# EasyEDA Pro project ProPrj_四串锂电池电源-2_2025-05-26.epro, board PCBV2
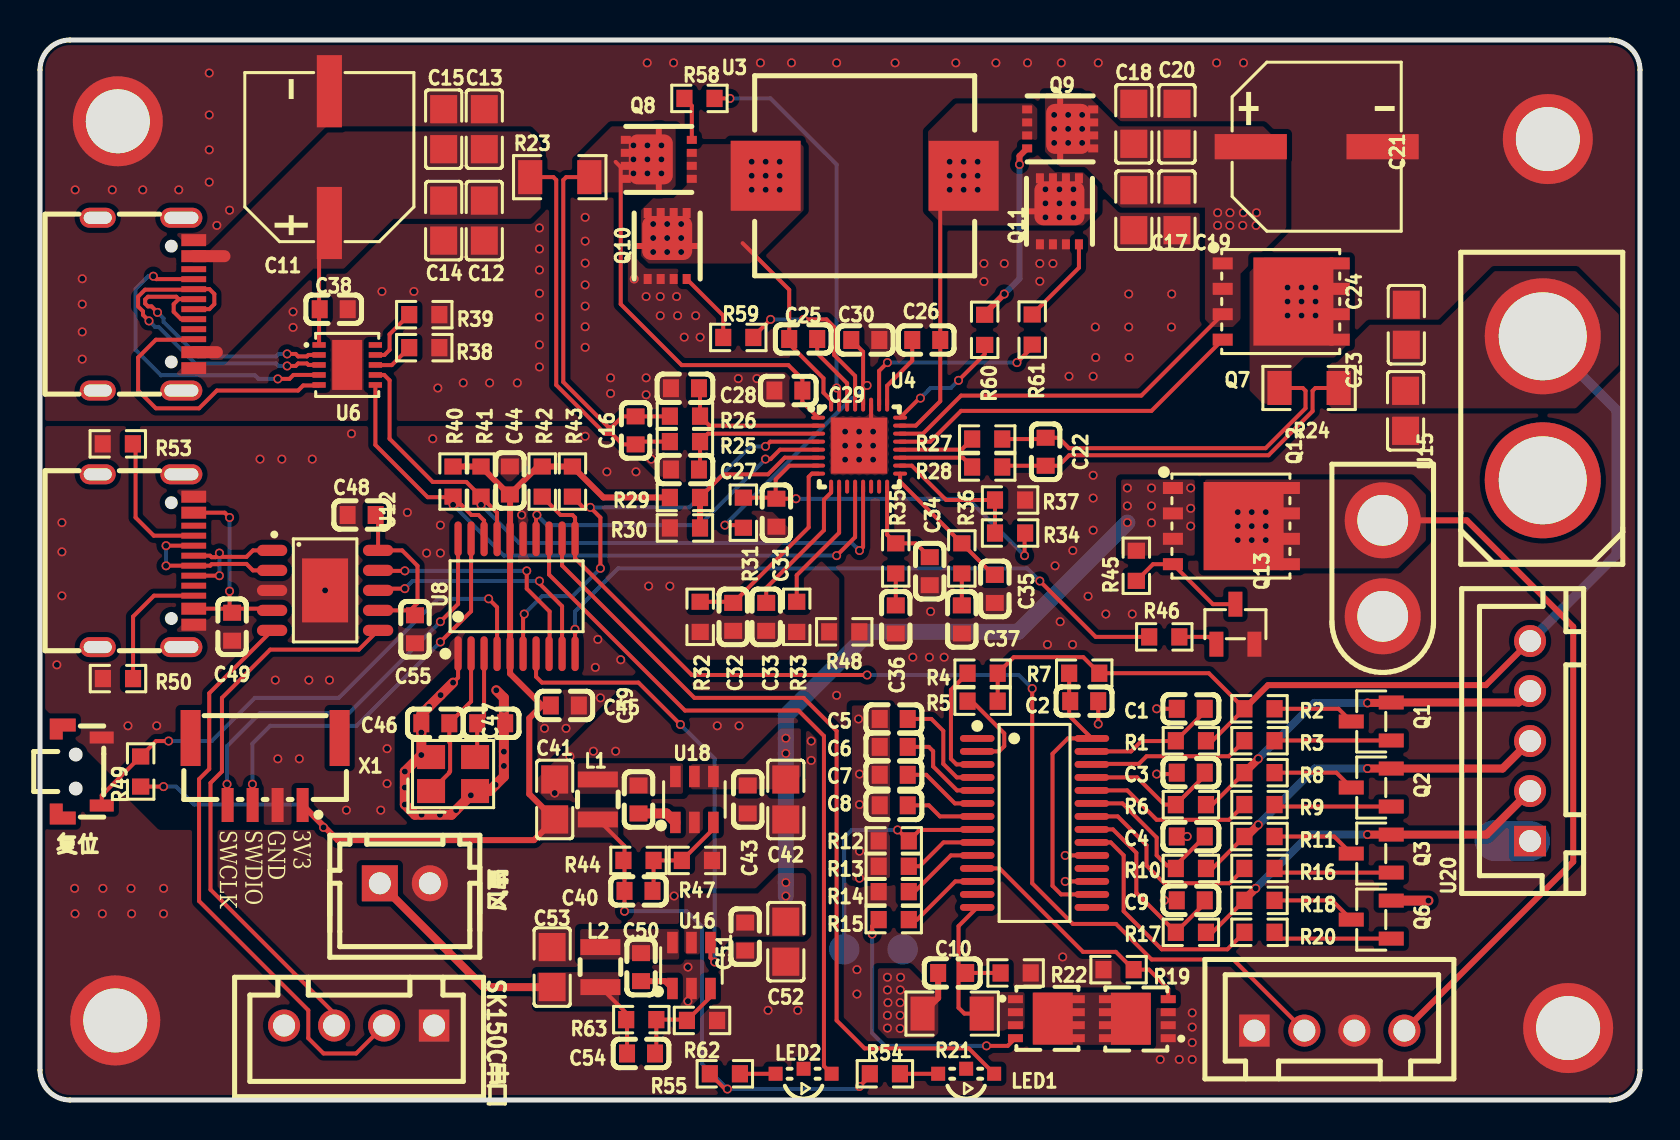
[diagram p12: board, top side]
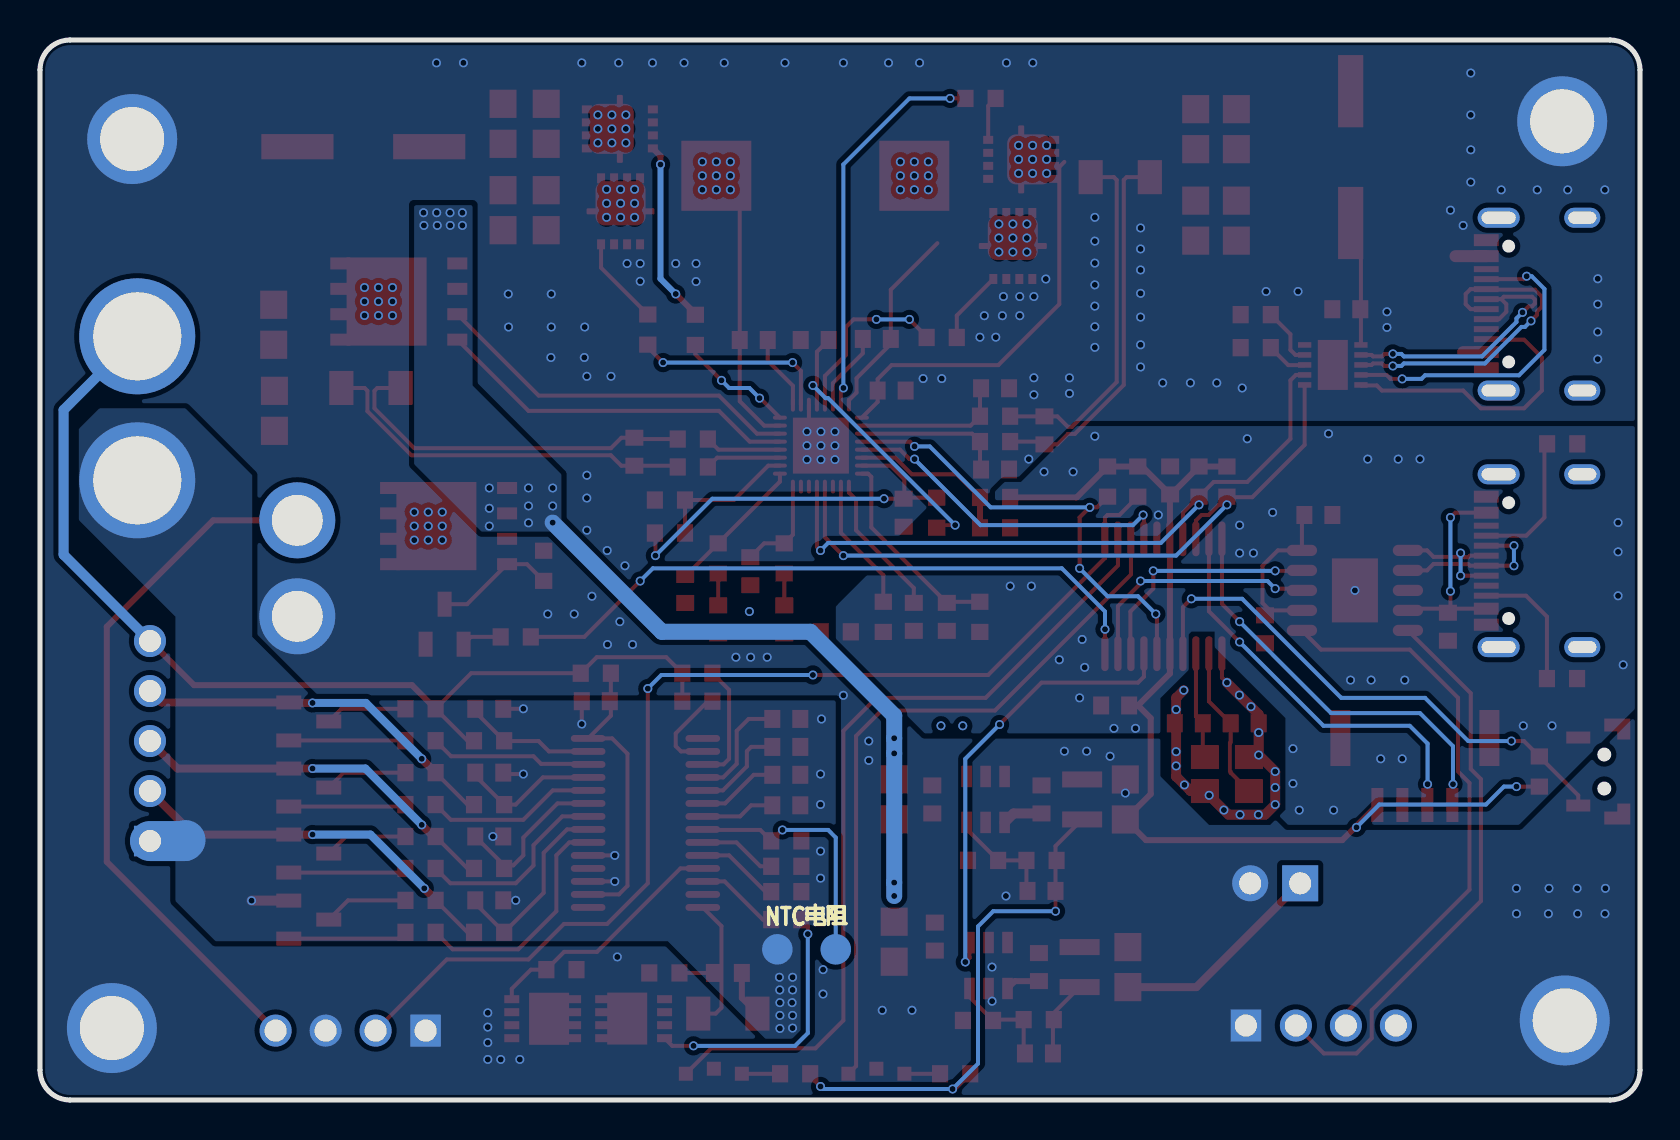
[diagram p13: board, bottom side, seen from below]

Outline 80 x 53 mm; copper layers: Top Layer, Bottom Layer. Coordinates in mm from the lower left corner of the outline.
Outline path: 0,51.5 0,1.5 arc(0.44,0.44) 1.5,0 78.5,0 arc(79.56,0.44) 80,1.5 80,51.5 arc(79.56,52.56) 78.5,53 1.5,53 arc(0.44,52.56) 0,51.5
Stack: Top Layer 0.035mm / Dielectric1 1.51mm FR4 er 4.5 / Bottom Layer 0.035mm

## Design rules (mm)
net BAT4: DP3
net $3N1407: DP4
net $3N1440: DP4
net $2N9896: DP2
net VBUS: DP2
net $2N9908: DP3
net D+: DP1
net D-: DP1
template: 自定义配置
spacing copperThickness1oz (default): track to track 0.102, other pairs 0.152 to 0.3
spacing copperThickness2oz: track to track 0.203, other pairs 0.152 to 0.3
track width copperThickness1oz (default): min 0.127, default 0.254, max 5
track width copperThickness2oz: min 0.203, default 0.254, max 2.54
differential pair differentialPair (default): width min 0.127, default 0.254, max 2.54; gap min 0.152, default 0.152
via viaSize (default): diameter min 0.45, default 0.61, max 10; hole min 0.3, default 0.305, max 6.3

## Placement (name value [footprint] x y rotation side)
C1  100nF  [C0603]  57.54 19.56 180 top
C2  10uF  [C0603]  52.21 19.94 0 top
C3  100nF  [C0603]  57.54 16.37 180 top
C4  100nF  [C0603]  57.54 13.18 180 top
C5  100nF  [C0603]  42.69 19.05 180 top
C6  100nF  [C0603]  42.69 17.66 180 top
C7  100nF  [C0603]  42.69 16.26 180 top
C8  100nF  [C0603]  42.69 14.73 180 top
C9  100nF  [C0603]  57.54 9.98 180 top
C10  10nF  [C0603]  45.61 6.35 180 top
C11  220uF  [CAP-SMD_BD8.0-L8.3-W8.3-LS9.0-FD]  14.47 47.14 90 top
C12  22uF  [C0805]  22.21 43.97 270 top
C13  22uF  [C0805]  22.21 48.54 90 top
C14  22uF  [C0805]  20.18 43.97 270 top
C15  22uF  [C0805]  20.18 48.54 90 top
C16  100nF  [C0603]  29.78 33.48 90 top
C17  22uF  [C0805]  54.69 44.49 270 top
C18  22uF  [C0805]  54.69 48.81 90 top
C19  22uF  [C0805]  56.85 44.49 270 top
C20  22uF  [C0805]  56.85 48.81 90 top
C21  220uF  [CAP-SMD_BD8.0-L8.3-W8.3-LS9.0-FD]  63.83 47.67 0 top
C22  100nF  [C0603]  50.28 32.41 270 top
C23  22uF  [C0805]  68.28 34.46 270 top
C24  22uF  [C0805]  68.32 38.76 90 top
C25  47nF  [C0603]  38.16 38.05 180 top
C26  47nF  [C0603]  44.31 38 180 top
C27  33nF  [C0603]  32.25 31.52 0 top
C28  33nF  [C0603]  32.25 35.59 0 top
C29  100nF  [C0603]  37.42 35.47 180 top
C30  2.2uF  [C0603]  41.26 38 0 top
C31  1uF  [C0603]  36.82 29.36 90 top
C32  20pF  [C0603]  34.66 24.16 90 top
C33  20pF  [C0603]  36.31 24.16 90 top
C34  NC  [C0603]  44.49 26.44 90 top
C35  NC  [C0603]  47.74 25.55 90 top
C36  220pF  [C0603]  42.79 24.03 90 top
C37  330pF  [C0603]  46.09 24.03 90 top
C38  100nF  [C0603]  14.69 39.54 180 top
C39  100nF  [C0603]  29.93 15.03 270 top
C40  100pF  [C0603]  29.93 10.45 180 top
C41  22uF  [C0805]  25.73 15.03 270 top
C42  100nF  [C0805]  37.29 15.03 90 top
C43  100nF  [C0603]  35.39 15.03 90 top
C44  100nF  [C0603]  23.49 30.98 90 top
C45  100nF  [C0603]  26.24 19.73 180 top
C46  20pF  [C0603]  19.77 18.84 0 top
C47  20pF  [C0603]  22.56 18.84 180 top
C48  100nF  [C0603]  16.08 29.25 0 top
C49  1uF  [C0603]  9.61 23.66 270 top
C50  100nF  [C0603]  30.05 6.64 270 top
C51  100nF  [C0603]  35.26 8.17 90 top
C52  100nF  [C0805]  37.29 7.91 90 top
C53  22uF  [C0805]  25.61 6.64 270 top
C54  100pF  [C0603]  30.05 2.33 180 top
C55  1uF  [C0603]  18.75 23.54 90 top
CN2  ZX-XH2.54-2PZZ  [CONN-TH_2P-P2.50_HX25003-2A]  18.24 10.84 0 top
CN3  ZX-XH2.54-4PZZ  [CONN-TH_4P-P2.50_4PIN]  15.95 3.72 180 top
CN4  ZX-XH2.54-4PZZ  [CONN-TH_4P-P2.50_4PIN]  64.47 3.47 0 top
L1  4.7uH  [IND-SMD_L2.5-W2.0_FWP252012P-2R2ML]  27.89 15.03 270 top
L2  4.7uH  [IND-SMD_L2.5-W2.0_FWP252012P-2R2ML]  28.02 6.64 270 top
LED1  MHS110WDT-C3  [LED-SMD_L3.0-W1.5_MHS110WDT-C1]  46.31 1.44 180 top
LED2  MHS110WDT-C3  [LED-SMD_L3.0-W1.5_MHS110WDT-C1]  38.18 1.44 180 top
NOREF  -  [Pad_e1374]  75.39 48.05 0 top
NOREF#2  -  [Pad_e671]  43.13 7.53 0 top
NOREF#3  -  [Pad_e1377]  3.76 3.98 0 top
NOREF#4  -  [Pad_e1371]  3.89 48.94 0 top
NOREF#5  -  [Pad_e1378]  76.41 3.6 0 top
NOREF#6  -  [Pad_e629]  40.21 7.53 0 top
Q1  2N7002K  [SOT-23-3_L2.9-W1.3-P1.90-LS2.4-BL-1]  66.56 18.93 90 top
Q2  2N7002K  [SOT-23-3_L2.9-W1.3-P1.90-LS2.4-BL-1]  66.56 15.62 90 top
Q3  2N7002K  [SOT-23-3_L2.9-W1.3-P1.90-LS2.4-BL-1]  66.56 12.32 90 top
Q4  RU3030M2  [PDFN3333-8_L3.1-W3.2-P0.65-LS3.4-BL]  54.88 4.07 90 top
Q5  RU3030M2  [PDFN3333-8_L3.1-W3.2-P0.65-LS3.4-BL]  50.31 4.07 270 top
Q6  2N7002K  [SOT-23-3_L2.9-W1.3-P1.90-LS2.4-BL-1]  66.56 9.02 90 top
Q7  HY12P03C2  [DFN-8_L5.9-W5.2-P1.27-LS6.2-BL]  62.06 39.92 270 top
Q8  TPN2R703NL  [TSON3x3]  30.94 47.03 90 top
Q9  TPN2R703NL  [TSON3x3]  51.01 48.55 270 top
Q10  TPN2R703NL  [TSON3x3]  31.36 42.7 0 top
Q11  TPN2R703NL  [TSON3x3]  50.97 44.43 0 top
Q12  HY12P03C2  [DFN-8_L5.9-W5.2-P1.27-LS6.2-BL]  59.57 28.7 270 top
Q13  -  [SOT-23-3_L2.9-W1.3-P1.90-LS2.4-BR]  59.77 23.79 270 top
R1  470Ω  [R0603]  57.55 17.96 0 top
R2  100Ω  [R0603]  60.97 19.56 180 top
R3  1MΩ  [R0603]  60.97 17.96 0 top
R4  1MΩ  [R0603]  47.13 21.34 0 top
R5  1MΩ  [R0603]  47.13 19.94 0 top
R6  470Ω  [R0603]  57.55 14.77 0 top
R7  470Ω  [R0603]  52.21 21.34 0 top
R8  100Ω  [R0603]  60.97 16.37 180 top
R9  1MΩ  [R0603]  60.97 14.77 0 top
R10  470Ω  [R0603]  57.55 11.58 0 top
R11  100Ω  [R0603]  60.97 13.17 180 top
R12  SDNT1608X103F3380FTF  [R0603]  42.69 12.96 0 top
R13  6.98kΩ  [R0603]  42.69 11.69 0 top
R14  47kΩ  [R0603]  42.69 10.42 0 top
R15  470Ω  [R0603]  42.69 9.02 0 top
R16  1MΩ  [R0603]  60.97 11.58 0 top
R17  470Ω  [R0603]  57.55 8.38 0 top
R18  100Ω  [R0603]  60.97 9.98 180 top
R19  10MΩ  [R0603]  53.93 6.52 0 top
R20  1MΩ  [R0603]  60.97 8.38 0 top
R21  5mΩ  [R1206]  45.61 4.32 180 top
R22  10MΩ  [R0603]  48.78 6.35 180 top
R23  10m  [R1206]  25.99 46.14 0 top
R24  10m  [R1206]  63.45 35.6 0 top
R25  5R1  [R0603]  32.25 32.92 180 top
R26  5R1  [R0603]  32.25 34.19 180 top
R27  10R  [R0603]  47.36 33.05 0 top
R28  10R  [R0603]  47.36 31.65 0 top
R29  1K  [R0603]  32.25 30.13 180 top
R30  10K  [R0603]  32.25 28.6 0 top
R31  10R  [R0603]  35.17 29.36 270 top
R32  169K  [R0603]  33.01 24.16 90 top
R33  30K  [R0603]  37.84 24.16 90 top
R34  3.3K  [R0603]  48.5 28.35 0 top
R35  68K  [R0603]  42.79 27.08 90 top
R36  27K  [R0603]  46.09 27.08 90 top
R37  10K  [R0603]  48.5 30 180 top
R38  NC  [R0603]  19.21 37.62 180 top
R39  NC  [R0603]  19.21 39.27 180 top
R40  4.7K  [R0603]  20.65 30.92 90 top
R41  4.7K  [R0603]  22.05 30.92 90 top
R42  4.7K  [R0603]  25.11 30.92 90 top
R43  4.7K  [R0603]  26.62 30.92 90 top
R44  147k  [R0603]  29.93 11.98 180 top
R45  100kΩ  [R0603]  54.82 26.71 90 top
R46  10kΩ  [R0603]  56.21 23.16 0 top
R47  47k  [R0603]  32.85 11.98 180 top
R48  0  [R0603]  40.21 23.41 180 top
R49  10K  [R0603]  5.03 16.42 270 top
R50  5.1K  [R0603]  3.9 21.07 180 top
R53  5.1K  [R0603]  3.89 32.81 180 top
R54  1K  [R0603]  42.24 1.31 180 top
R55  1K  [R0603]  34.24 1.31 180 top
R58  0  [R0603]  32.97 50.08 180 top
R59  0  [R0603]  34.91 38.13 180 top
R60  0  [R0603]  47.23 38.51 270 top
R61  0  [R0603]  49.61 38.52 270 top
R62  20K  [R0603]  33.1 3.98 180 top
R63  105K  [R0603]  30.06 4.02 180 top
SW2  TS24CA  [SW-SMD_TS24CA]  2.11 16.42 90 top
U1  BM3451UNDC-T28A  [TSSOP-28_L9.7-W4.4-P0.65-LS6.4-BL]  49.73 13.85 270 top
U3  4.7uH  [IND-SMD_L11.0-W10.0]  41.23 46.21 0 top
U4  SC8886SQDER  [QFN-32_L4.0-W4.0-P0.40-BL-EP2.8]  40.96 32.72 270 top
U5  GT-USB-7010ASV  [USB-C-SMD_G-SWITCH_GT-USB-7010ASV]  5.29 39.79 270 top
U6  HUSB238_002DD  [DFN-10_L3.0-W3.0-P0.50-BL-EP2.5]  15.36 36.75 270 top
U8  STM32F030F4P6  [TSSOP-20_L6.5-W4.4-P0.65-LS6.4-BL]  23.83 25.19 0 top
U10  WAFER-GH1.25-4PLB  [CONN-SMD_4P-P1.25_XUNPU_WAFER-GH1.25-4PLB]  11.26 16.42 180 top
U11  GT-USB-7010ASV  [USB-C-SMD_G-SWITCH_GT-USB-7010ASV]  5.29 26.97 270 top
U12  CH342K  [SSOP-10_L5.0-W3.9-P1.00-LS6.0-BL-EP]  14.25 25.48 270 top
U15  XT30U-F  [CONN-TH_XT30U-F]  67.14 26.58 270 top
U16  RY8411  [SOT-23-6_L2.9-W1.6-P0.95-LS2.8-TL]  32.57 6.72 90 top
U18  RY8411  [SOT-23-6_L2.9-W1.6-P0.95-LS2.8-TL]  32.72 15.03 90 top
U19  XT60  [CONN-TH_XT60]  75.14 34.58 90 top
U20  ZX-XH2.54-5PZZ  [CONN-TH_5P-P2.50_ZX-XH2.54-5PZZ]  74.5 17.95 90 top
X1  8MHz  [CRYSTAL-SMD_4P-L3.2-W2.5-BL]  20.65 16.3 0 top

## Footprints (pads in the part's own frame, mm; a bottom-side part is the same pattern mirrored in y, then rotated)
C0603
  rect 0.8x0.9 smd: 1(-0.7,0) 2(0.7,0)
C0805
  rect 1.41x1.35 smd: 1(-1,0) 2(1,0)
CAP-SMD_BD8.0-L8.3-W8.3-LS9.0-FD
  rect 3.61x1.26 smd: 1(-3.295,0) 2(3.295,0)
CONN-SMD_4P-P1.25_XUNPU_WAFER-GH1.25-4PLB
  rect 0.6x1.7 smd: 1(-1.875,1.675) 2(-0.625,1.675) 3(0.625,1.675) 4(1.875,1.675)
  rect 1x2.8 smd: 5(-3.725,-1.675) 6(3.725,-1.675)
CONN-TH_2P-P2.50_HX25003-2A
  rect 1.8x1.8 hole 1.1: 1(-1.25,0)
  round 1.8 hole 1.1: 2(1.25,0)
CONN-TH_4P-P2.50_4PIN
  rect 1.524x1.6 hole 1.1: 1(-3.75,0)
  round 1.6 hole 1.1: 2(-1.25,0) 3(1.25,0) 4(3.75,0)
CONN-TH_5P-P2.50_ZX-XH2.54-5PZZ
  rect 1.524x1.6 hole 1.1: 1(-5,0)
  round 1.6 hole 1.1: 2(-2.5,0) 3(0,0) 4(2.5,0) 5(5,0)
CONN-TH_XT30U-F
  round 3.8 hole 2.54: 1(2.4,0) 2(-2.4,0)
CONN-TH_XT60
  round 5.8 hole 4.4: 1(-3.6,0) 2(3.6,0)
CRYSTAL-SMD_4P-L3.2-W2.5-BL
  rect 1.4x1.2 smd: 1(-1.1,-0.85) 2(1.1,-0.85) 3(1.1,0.85) 4(-1.1,0.85)
DFN-8_L5.9-W5.2-P1.27-LS6.2-BL
  rect 0.6x1 smd: 1(-1.905,-2.925) 2(-0.635,-2.925) 3(0.635,-2.925) 4(1.905,-2.925) 5(1.905,2.925) 6(0.635,2.925) 7(-0.635,2.925) 8(-1.905,2.925)
  rect 4.41x4 smd: 9(0,0.61)
DFN-10_L3.0-W3.0-P0.50-BL-EP2.5
  rect 0.28x0.665 smd: 1(-1,-1.407) 2(-0.5,-1.407) 3(0,-1.407) 4(0.5,-1.407) 5(1,-1.407) 6(1,1.407) 7(0.5,1.407) 8(0,1.407) 9(-0.5,1.407) 10(-1,1.407)
  rect 2.5x1.5 smd: 11(0,0)
IND-SMD_L2.5-W2.0_FWP252012P-2R2ML
  rect 0.8x2 smd: 1(-1,0) 2(1,0)
IND-SMD_L11.0-W10.0
  rect 3.5x3.5 smd: 1(-4.95,0) 2(4.95,0)
LED-SMD_L3.0-W1.5_MHS110WDT-C1
  rect 0.7x0.7 smd: 1(1.4,0.125) 2(-1.4,0.125) 3(0,-0.125)
Pad_e629
  round 1.524 smd far side: 1(0,0)
Pad_e671
  round 1.524 smd far side: 1(0,0)
Pad_e1371
  round 4.5 hole 3.2: 1(0,0)
Pad_e1374
  round 4.5 hole 3.2: 1(0,0)
Pad_e1377
  round 4.5 hole 3.2: 1(0,0)
Pad_e1378
  round 4.5 hole 3.2: 1(0,0)
PDFN3333-8_L3.1-W3.2-P0.65-LS3.4-BL
  rect 0.4x0.75 smd: 1(-0.975,-1.534) 2(-0.325,-1.534) 3(0.325,-1.534) 4(0.975,-1.534)
  rect 0.4x0.8 smd: 5(0.975,1.534) 6(0.325,1.534) 7(-0.325,1.534) 8(-0.975,1.534)
  rect 2.6x2 smd: 9(-0.004,0.333)
QFN-32_L4.0-W4.0-P0.40-BL-EP2.8
  oval 0.2x0.7 smd: 1(-1.4,-2.05) 2(-1,-2.05) 3(-0.6,-2.05) 4(-0.2,-2.05) 5(0.2,-2.05) 6(0.6,-2.05) 7(1,-2.05) 8(1.4,-2.05) 17(1.4,2.05) 18(1,2.05) 19(0.6,2.05) 20(0.2,2.05) 21(-0.2,2.05) 22(-0.6,2.05) 23(-1,2.05) 24(-1.4,2.05)
  oval 0.7x0.2 smd: 9(2.05,-1.4) 10(2.05,-1) 11(2.05,-0.6) 12(2.05,-0.2) 13(2.05,0.2) 14(2.05,0.6) 15(2.05,1) 16(2.05,1.4) 25(-2.05,1.4) 26(-2.05,1) 27(-2.05,0.6) 28(-2.05,0.2) 29(-2.05,-0.2) 30(-2.05,-0.6) 31(-2.05,-1) 32(-2.05,-1.4)
  rect 2.8x2.8 smd: 33(0,0)
R0603
  rect 0.806x0.864 smd: 1(-0.753,0) 2(0.753,0)
R1206
  rect 1.208x1.701 smd: 1(-1.479,0) 2(1.479,0)
SOT-23-3_L2.9-W1.3-P1.90-LS2.4-BL-1
  rect 0.7x1.25 smd: 1(-0.95,-1) 2(0.95,-1) 3(0,1)
SOT-23-3_L2.9-W1.3-P1.90-LS2.4-BR
  rect 1.25x0.7 smd: 1(1,-0.95) 2(1,0.95) 3(-1,0)
SOT-23-6_L2.9-W1.6-P0.95-LS2.8-TL
  rect 1.072x0.532 smd: 1(-1.149,0.95) 2(-1.149,0) 3(-1.149,-0.95) 4(1.149,-0.95) 5(1.149,0) 6(1.149,0.95)
SSOP-10_L5.0-W3.9-P1.00-LS6.0-BL-EP
  oval 0.56x1.515 smd: 1(-2,-2.65) 2(-1,-2.65) 3(0,-2.65) 4(1,-2.65) 5(2,-2.65) 6(2,2.65) 7(1,2.65) 8(0,2.65) 9(-1,2.65) 10(-2,2.65)
  rect 3.2x2.3 smd: 11(0,0)
SW-SMD_TS24CA
  custom 1.05x1.3 smd: 1(-2.125,0.975) 2(2.125,0.975)
  rect 0.6x1.2 smd: 3(-1.7,-0.975) 4(1.7,-0.975)
TSON3x3
  rect 0.4x0.5 smd: 1(-0.975,1.65) 1(-0.325,1.65) 1(0.325,1.65) 1(0.975,1.65) 2(0.975,-1.65) 3(-0.975,-1.65) 3(-0.325,-1.65) 3(0.325,-1.65)
  rrect 2.5x2.2 smd: 1(0,0.4)
  rrect 3.4x0.3 smd: 1(0,0)
TSSOP-20_L6.5-W4.4-P0.65-LS6.4-BL
  oval 0.364x1.742 smd: 1(-2.925,-2.871) 2(-2.275,-2.871) 3(-1.625,-2.871) 4(-0.975,-2.871) 5(-0.325,-2.871) 6(0.325,-2.871) 7(0.975,-2.871) 8(1.625,-2.871) 9(2.275,-2.871) 10(2.925,-2.871) 11(2.925,2.871) 12(2.275,2.871) 13(1.625,2.871) 14(0.975,2.871) 15(0.325,2.871) 16(-0.325,2.871) 17(-0.975,2.871) 18(-1.625,2.871) 19(-2.275,2.871) 20(-2.925,2.871)
TSSOP-28_L9.7-W4.4-P0.65-LS6.4-BL
  oval 0.343x1.732 smd: 1(-4.225,-2.866) 2(-3.575,-2.866) 3(-2.925,-2.866) 4(-2.275,-2.866) 5(-1.625,-2.866) 6(-0.975,-2.866) 7(-0.325,-2.866) 8(0.325,-2.866) 9(0.975,-2.866) 10(1.625,-2.866) 11(2.275,-2.866) 12(2.925,-2.866) 13(3.575,-2.866) 14(4.225,-2.866) 15(4.225,2.866) 16(3.575,2.866) 17(2.925,2.866) 18(2.275,2.866) 19(1.625,2.866) 20(0.975,2.866) 21(0.325,2.866) 22(-0.325,2.866) 23(-0.975,2.866) 24(-1.625,2.866) 25(-2.275,2.866) 26(-2.925,2.866) 27(-3.575,2.866) 28(-4.225,2.866)
USB-C-SMD_G-SWITCH_GT-USB-7010ASV
  oval 1x2.1 hole 0.6x1.7: 1(-4.32,1.78) 2(4.32,1.78)
  oval 1x1.8 hole 0.6x1.4: 3(4.32,-2.4) 4(-4.32,-2.4)
  rect 0.6x1.24 smd: A1B12(-3.2,2.4) A4B9(-2.4,2.4) B1A12(3.2,2.4) B4A9(2.4,2.4)
  rect 0.3x1.24 smd: A5(-1.25,2.4) A6(-0.25,2.4) A7(0.25,2.4) A8(1.25,2.4) B5(1.75,2.4) B6(0.75,2.4) B7(-0.75,2.4) B8(-1.75,2.4)

## Nets
As in the schematic, except:
GND: C11.2 C12.2 C13.2 C14.2 C15.2 C17.2 C18.2 C19.2 C20.2 C21.2 C23.2 C24.2 C27.1 C28.1 C29.2 C30.2 C34.1 C35.1 C36.1 C37.1 C38.1 C41.1 C42.1 C43.1 C51.1 C52.1 C53.1 CN2.2 CN3.1 CN4.1 CN4.3 NOREF.1 NOREF#3.1 NOREF#4.1 NOREF#5.1 Q4.1 Q4.2 Q4.3 Q10.3 Q11.3 Q13.2 R14.1 R19.1 R22.1 R37.1 R38.1 R39.1 R47.1 R48.1 R62.1 U4.27 U4.33 U5.A1B12 U5.B1A12 U6.11 U15.1 U16.2 U18.2
B-: C1.2 C2.2 C3.2 C4.2 C5.2 C6.2 C7.2 C8.2 C9.2 C10.2 NOREF#2.1 Q6.2 R12.1 R13.1 R21.2 U1.17 U1.19 U19.1 U20.1
$1N1982: NOREF#6.1 R12.2 U1.8
$2N18353: Q8.2 R58.2
$2N18407: Q10.2 R59.2
$2N18436: Q9.2 R60.1
$2N18466: Q11.2 R61.1

Pads without a net: LED1 3; LED2 3; SW2 1 2; U1 1 13 15 18; U4 11; U5 1 2 3 4 A8 B8; U6 10; U10 5 6; U11 1 2 3 4 A8 B8

## Via types
v1: diameter 0.45, hole 0.3, Top Layer to Bottom Layer, 371 vias

## Routing (per net, layer and track width the routed paths; a pad name or vN(x,y) marks a point on that pad's centre or on a via; arc(x,y) is an arc through that point)
3.3V: length 81.2
  Top Layer w0.2: R54.2 41.49,1.19 v1(40.97,0.68) ; v1(34.37,0.55) 34.25,0.55 R55.2 ; L1.2 29.22,12.69 C40.2 v1(29.22,9.44) ; R49.2 v1(6.18,15.67)
  Top Layer w0.3: 25.1,19.73 C45.2 ; 25.1,19.73 23.5,21.32 U8.5 U8.16 23.5,30.27 C44.1 ; 25.1,19.73 24.46,19.09 24.46,15.3 C41.2 24.7,12.99 14.89,12.99 U10.1 ; R40.2 R41.2 23.45,30.28 C44.1 ; C44.1 24.89,31.67 R42.2 R43.2 28.17,30.13 R29.2
  Bottom Layer w0.2: v1(40.97,0.68) 40.85,0.55 v1(34.37,0.55) 33.1,1.82 33.1,8.68 32.34,9.44 v1(29.22,9.44) ; v1(14.18,13.63) 13.03,14.77 7.7,14.77 6.8,15.67 v1(6.18,15.67)
5V: length 14.6
  Top Layer w0.2: C54.2 29.35,4.31 L2.2
  Top Layer w0.4: CN2.1 22.18,5.64 C53.2
AGND: length 19.1
  Top Layer w0.2: U8.1 20.9,21.12 v1(20.65,20.87)
  Top Layer w0.5: v1(20.65,20.87) v1(20.03,20.24) v1(19.45,19.67) 19.06,19.28 C46.1 v1(19.06,18.37) v1(19.06,17.25) v1(18.24,16.42) v1(18.24,15.62) v1(18.24,14.77) 18.75,14.27 v1(19.08,14.27) v1(20,14.27) 20.57,14.27 v1(20.81,14.5) v1(21.54,15.23) X1.2 22.47,15.45 v1(22.78,15.76) 23.19,16.17 v1(23.19,16.7) v1(23.19,17.42) v1(23.19,19.52) 23.19,20.11 v1(22.81,20.49)
  vias: v1(0.84,21.76) v1(1.1,28.87) v1(1.1,27.41) v1(1.1,25.21) v1(4.4,18.71) v1(5.84,18.71) v1(11,32.05) v1(11.76,21) v1(11.89,17.06) v1(12.09,32.05) v1(12.97,17.06) v1(13.44,21) v1(13.61,32.05) v1(14.25,25.48) v1(14.47,21) v1(15.32,14.49) v1(15.57,33.31) v1(17.04,14.49) v1(17.35,17.57) v1(17.35,15.82) v1(18.37,29.38) v1(19.33,27.35) v1(19.64,33.06) v1(20.02,28.74) v1(20.02,27.35) v1(24.08,29.25) v1(25.23,18.58) v1(26.3,18.58) v1(27.26,33.19) v1(27.77,21.63) v1(27.89,23.03) v1(28.02,20.11) v1(28.34,31.41) v1(29.04,22.01) v1(29.8,31.41) v1(30.43,25.69) v1(31.49,25.69)
GND: length 2.3
  Top Layer w0.2: U4.27 41.55,33.32 v1(40.96,32.72)
  vias: v1(1.76,45.51) v1(1.73,10.58) v1(1.75,9.31) v1(2.11,41.06) v1(2.11,39.79) v1(2.11,38.41) v1(2.11,37.05) v1(3.15,10.58) v1(3.12,9.31) v1(3.61,45.51) v1(4.55,10.58) v1(4.58,9.31) v1(5.14,45.51) v1(6.18,10.58) v1(6.18,9.31) v1(6.94,45.51) v1(8.46,51.35) v1(8.46,49.25) v1(8.46,47.51) v1(8.46,45.9) v1(8.84,43.73) v1(9.48,44.49) v1(12.65,39.41) v1(12.65,38.63) v1(17.1,40.43) v1(18.7,40.43) v1(19.89,35.6) v1(21.16,35.85) v1(22.48,35.85) v1(23.87,35.85) v1(24.97,43.6) v1(24.97,42.55) v1(24.97,41.5) v1(24.97,40.33) v1(24.97,39.14) v1(24.97,37.76) v1(24.97,36.65) v1(25.73,15.35) v1(26.5,17.19) v1(27.26,44.13) v1(27.26,42.94) v1(27.26,41.85) v1(27.26,40.76) v1(27.26,39.69) v1(27.26,38.66) v1(27.26,37.63) v1(27.67,17.44) v1(28.53,36.11) v1(28.53,35.33) v1(28.78,17.44) v1(29.71,41.05) v1(30.36,51.86) v1(30.31,40.17) v1(30.31,36.11) v1(30.31,35.26) v1(30.56,32.05) v1(31.01,40.17) v1(31.01,39.22) v1(31.68,51.86) v1(31.7,10.2) v1(31.83,40.17) v1(31.88,39.22) v1(32.21,38.14) v1(32.4,6.64) v1(32.4,4.94) v1(32.78,39.22) v1(33,38.14) v1(33.86,18.71) v1(34.91,36.07) v1(34.95,18.71) v1(35.84,36.07) v1(36.02,51.86) v1(36.4,4.49) v1(37.57,51.86) v1(37.89,4.49) v1(38.56,17.95) v1(38.56,16.98) v1(39.83,51.86) v1(39.83,20.23) v1(40.25,33.42) v1(40.25,32.72) v1(40.25,32.02) v1(40.85,6.52) v1(40.85,5.3) v1(40.96,33.42) v1(40.96,32.02) v1(41.66,33.42) v1(41.66,32.72) v1(41.66,32.02) v1(42.75,51.86) v1(43.64,22.14) v1(44.47,22.14) v1(44.53,24.42) v1(45.21,22.14) v1(45.79,51.86) v1(47.2,41.82) v1(47.2,40.92) v1(47.8,51.86) v1(48.21,41.82) v1(49.38,51.86) v1(49.99,41.82) v1(49.99,40.94) v1(50.37,22.77) v1(50.65,41.82) v1(50.75,26.71) v1(51.07,51.86) v1(51.01,23.92) v1(51.13,7.15) v1(51.45,36.18) v1(51.64,27.47) v1(51.63,22.77) v1(52.4,25.19) v1(52.66,36.18) v1(52.66,31.24) v1(52.66,30.1) v1(52.66,28.49) v1(52.77,38.65) v1(52.78,37.12) v1(52.91,51.86) v1(53.29,24.3) v1(54.44,40.3) v1(54.44,38.65) v1(54.46,37.12) v1(54.61,24.3) v1(56.01,2.03) v1(56.59,40.3) v1(56.57,38.65) v1(56.96,2.03) v1(57.61,4.36) v1(57.61,3.64) v1(57.61,2.87) v1(57.61,2.03) v1(58.83,51.86) v1(60.18,51.86)
VBUS: length 27.7
  Top Layer w0.2: C11.1 14.22,43.85 13.95,43.58 U6.1 ; R23.1 25.67,46.14 25.81,46 25.81,35.75 28.26,33.3 28.6,33.3 29.13,32.78 29.78,32.78 29.92,32.92 R25.2
  Top Layer w0.6: U5.A4B9 9.22,42.19 ; U5.B4A9 8.84,37.39
VDDA: length 19.7
  Top Layer w0.2: 36.82,29.92 36.82,29.98 36.78,30.02 ; R31.1 36.68,30.12 36.78,30.22 36.78,31.03 37.47,31.72 38.9,31.72 ; v1(49.23,27.22) 49.23,28.32 R34.2 ; C31.2 v1(37.8,30.06)
  Bottom Layer w0.2: v1(37.8,30.06) 46.38,30.06 v1(49.23,27.22)
VIN: length 8.4
  Top Layer w0.2: R21.1 46.22,4.32 45.93,4.61 45.93,8.69 U1.14 ; R22.2 C10.1
B-: length 13
  Top Layer w0.2: U1.17 v1(51.26,10.93) ; C9.2 v1(56.21,9.98) ; U1.19 v1(51.26,12.23) ; v1(55.83,16.3) 56.77,16.3 C3.2 ; 52.91,19.94 v1(52.91,18.8) ; C1.2 v1(55.83,19.56) ; C4.2 v1(57.36,13.18)
  Top Layer w0.3: 44.13,4.32 44.91,5.1 C10.2
  Top Layer w0.5: Q6.2 v1(69.42,9.97)
  Bottom Layer w2: U20.1 72.77,12.95 72.72,12.99
  vias: v1(40.93,19.05) v1(40.97,16.3) v1(40.97,14.77) v1(40.97,12.44) v1(40.97,11.09) v1(42.37,6.14) v1(42.37,5.5) v1(42.4,4.87) v1(42.37,4.23) v1(42.37,3.6) v1(43.03,6.14) v1(43.01,5.5) v1(43.01,4.87) v1(43.01,4.23) v1(43.01,3.58)
BAT1: length 19.2
  Top Layer w0.2: R17.2 58.62,8.38 R18.2
  Top Layer w0.4: v1(66.37,13.27) Q3.2 72.33,13.27 U20.2 ; R18.2 60.22,10.02 v1(60.79,10.58)
  Bottom Layer w0.4: v1(60.79,10.58) 63.48,13.27 v1(66.37,13.27)
BAT2: length 18.8
  Top Layer w0.2: R11.2 58.62,11.58 R10.2
  Top Layer w0.4: v1(60.91,13.76) 60.33,13.17 R11.2 ; U20.3 73.13,16.57 Q2.2 v1(66.37,16.57)
  Bottom Layer w0.4: v1(66.37,16.57) 63.73,16.57 v1(60.91,13.76)
BAT3: length 18.6
  Top Layer w0.2: R6.2 58.62,14.77 R8.2
  Top Layer w0.4: v1(60.91,17.06) R8.2 ; v1(66.37,19.85) 67.54,19.85 Q1.2 73.93,19.88 U20.4
  Bottom Layer w0.4: v1(60.91,17.06) 63.71,19.85 v1(66.37,19.85)
BAT4: length 71
  Top Layer w0.2: R5.2 R4.2 48.69,22.14 52.16,22.14 R7.2 58.44,21.34 R2.2 58.62,17.96 R1.2 ; R28.2 48.18,31.71 C22.2 50.93,31.71 51.46,32.24 61.43,32.24 63.63,34.44 63.63,35.46 63.77,35.6 R24.2
  Top Layer w0.3: U20.5 72.3,20.74 61.4,20.74 R2.2
  Bottom Layer w0.5: U19.2 78.82,34.5 78.82,27.27 U20.5
BT1: length 3.9
  Top Layer w0.2: C25.1 38.86,37.33 40.35,35.84 U4.30
BT2: length 3.8
  Top Layer w0.2: U4.25 42.35,35.71 43.61,36.97 C26.2
CC1: length 16.1
  Top Layer w0.2: v1(5.67,41.19) 5.81,41.04 U5.A5 ; v1(11.89,36.05) 12.47,36.05 12.67,36.25 U6.4
  Bottom Layer w0.2: v1(11.89,36.05) 10.93,36.05 10.75,36.24 6.05,36.24 4.78,37.51 4.78,40.55 5.41,41.19 v1(5.67,41.19)
CC2: length 14.7
  Top Layer w0.2: U5.B5 7.66,38.01 5.8,38.01 4.91,37.12 4.91,35.47 5.8,34.58 7.95,34.58 8.84,35.47 12.91,35.47 13.16,35.73 13.93,35.73 U6.5
CHRG_OK: length 23.9
  Top Layer w0.2: 26.62,30.17 27.16,29.63 v1(27.51,29.63) 28.02,29.12 v1(28.02,26.58) ; 38.9,32.92 36.51,32.92 v1(36.28,32.68) ; U8.6 24.15,24.24 v1(24.21,24.3)
  Bottom Layer w0.2: v1(24.21,24.3) 25.1,25.19 26.62,25.19 v1(28.02,26.58) ; v1(27.51,29.63) 32.47,29.63 35.51,32.68 v1(36.28,32.68)
D+: length 14.7
  Top Layer w0.2: 6.93,40.04 U5.A6 ; 6.93,40.04 6.68,39.79 6.68,39.41 7.05,39.04 U5.B6 ; 6.93,40.04 6.81,40.16 5.4,40.16 5.26,40.02 5.26,39.82 5.4,39.68 5.58,39.68 v1(5.88,39.38) ; v1(12.36,37.3) 12.78,37.3 12.91,37.18 13.35,37.18 13.42,37.25 U6.2
  Bottom Layer w0.2: v1(12.36,37.3) 11.93,37.3 11.81,37.18 7.9,37.18 6.18,38.9 6.18,39.08 v1(5.88,39.38)
D-: length 16.7
  Top Layer w0.2: U6.3 13.42,36.75 13.35,36.83 12.91,36.83 12.78,36.7 v1(12.36,36.7) ; U5.A7 8.47,39.54 8.72,39.79 8.72,40.3 8.47,40.54 U5.B7 7.66,40.52 5.25,40.52 4.91,40.17 4.91,39.68 5.15,39.43 5.15,39.25 v1(5.45,38.95)
  Bottom Layer w0.2: v1(12.36,36.7) 11.93,36.7 11.81,36.83 7.75,36.83 5.93,38.65 5.75,38.65 v1(5.45,38.95)
FAN: length 23
  Top Layer w0.2: U16.4 33.52,7.11 v1(33.74,6.9) ; U8.7 24.8,21.16 25.1,20.87 29.93,20.87 v1(32.02,18.77)
  Bottom Layer w0.2: v1(32.02,18.77) 33.74,17.06 v1(33.74,6.9)
HD1: length 19.5
  Top Layer w0.2: v1(39.83,35.6) 39.96,35.48 U4.31 ; v1(34.5,50.08) R58.1
  Bottom Layer w0.2: v1(34.5,50.08) 36.53,50.08 39.83,46.78 v1(39.83,35.6)
HD2: length 6
  Top Layer w0.2: R60.2 47.23,37.29 v1(45.93,35.98) ; 43,34.12 43.98,35.09 v1(44.02,35.09)
  Bottom Layer w0.2: v1(44.02,35.09) 44.53,35.6 45.55,35.6 v1(45.93,35.98)
ILIM_HIZ: length 8.3
  Top Layer w0.2: 38.9,32.12 37.24,32.12 36.4,31.28 34.16,31.28 R29.1
  Top Layer w0.3: R29.1 R30.2
KEY: length 56.1
  Top Layer w0.2: CN4.2 59.66,7.03 55.58,7.03 53.8,8.8 51.64,8.8 49.61,10.84 v1(49.61,20.57) ; v1(41.35,21.25) 32.59,21.25 26.75,27.09 26.75,29.12 26.62,29.25 26.03,29.25 25.11,30.17
  Bottom Layer w0.2: v1(49.61,20.57) 48.93,21.25 v1(41.35,21.25)
LD1: length 8.9
  Top Layer w0.2: U4.29 40.75,36.2 39.7,37.25 39.7,38.65 39.32,39.03 v1(38.18,39.03) ; 35.67,38.13 35.67,38.17 v1(36.53,39.03)
  Bottom Layer w0.2: v1(38.18,39.03) v1(36.53,39.03)
LD2: length 10
  Top Layer w0.2: R61.2 49.61,37.63 v1(48.85,36.87) ; U4.26 41.96,36.45 v1(42.37,36.87)
  Bottom Layer w0.2: v1(42.37,36.87) v1(48.85,36.87)
LED1: length 41.9
  Top Layer w0.2: LED1.2 46.44,2.58 41.23,2.58 39.83,3.98 39.83,18.46 38.18,20.11 32.72,20.11 26.1,26.72 U8.12
LED2: length 35.9
  Top Layer w0.2: U8.13 25.45,26.27 32.25,19.47 37.93,19.47 39.2,18.2 39.2,1.7 LED2.2
OSCIN: length 7.7
  Top Layer w0.2: X1.1 20.47,16.36 20.47,16.4 20.51,16.44 20.51,17.85 20.47,17.89 C46.2 21.55,19.93 U8.2
OSCOUT: length 5.4
  Top Layer w0.2: X1.3 21.86,17.25 C47.2 22.2,19.18 U8.3
OTGNAP: length 17
  Top Layer w0.2: U4.5 37,32.52 36.53,32.05 v1(36.28,32.05) ; U8.14 24.8,29.21 v1(24.84,29.25)
  Bottom Layer w0.2: v1(24.84,29.25) 25.35,28.74 32.97,28.74 v1(36.28,32.05)
PA4: length 33.1
  Top Layer w0.2: 26.75,22.32 26.75,23.53 v1(26.75,23.54) ; v1(49.99,25.95) 52.78,23.16 R46.1
  Bottom Layer w0.2: v1(49.99,25.95) 49.36,26.58 28.91,26.58 26.75,24.42 v1(26.75,23.54)
RST: length 26.8
  Top Layer w0.2: v1(22.43,25.06) 22.85,24.64 U8.4 ; v1(6.43,17.95) 5.8,17.95 R49.1 3.09,15.23 SW2.3
  Bottom Layer w0.2: v1(22.43,25.06) 19.89,25.06 14.94,20.11 10.75,20.11 8.59,17.95 v1(6.43,17.95)
RX1: length 28.4
  Top Layer w0.2: U12.6 15.94,22.52 11.51,22.52 9.1,20.11 9.1,16.42 8.53,15.85 8.53,10.52 14.7,4.34 CN3.3
RX2: length 12.1
  Top Layer w0.2: U12.9 16.93,26.46 v1(18.24,26.46) ; v1(24.34,26.46) 24.34,25.57 25.48,24.42 25.48,22.34 U8.8
  Bottom Layer w0.2: v1(24.34,26.46) v1(18.24,26.46)
SCL: length 35.5
  Top Layer w0.2: U8.17 22.85,29.36 22.05,30.17 ; 22.05,29.76 22.05,30.17 ; 22.05,30.17 21.32,30.9 19.64,30.9 17.48,33.06 17.48,35.98 17.21,36.25 U6.7 ; U4.13 41.15,27.65 v1(40.97,27.47)
  Bottom Layer w0.2: v1(40.97,27.47) 40.59,27.85 23.96,27.85 v1(22.05,29.76)
SDA: length 34.8
  Top Layer w0.2: 20.65,30.17 20.62,30.14 19.38,30.14 16.77,32.76 U6.6 ; U4.12 40.75,28.14 v1(39.83,27.22) ; U8.18 22.2,28.97 21.92,29.25 21.57,29.25 21.06,29.76 v1(20.65,29.76)
  Bottom Layer w0.2: v1(20.65,29.76) 23.19,27.22 v1(39.83,27.22)
SW1: length 9.9
  Top Layer w0.2: U4.32 39.55,34.99 39.17,35.37 39.17,36.08 37.46,37.8 C25.2 37.46,40.51 35.13,42.84
  vias: v1(30.66,43.8) v1(30.66,43.1) v1(30.66,42.4) v1(31.36,43.8) v1(31.36,43.1) v1(31.36,42.4) v1(32.06,43.8) v1(32.06,43.1) v1(32.06,42.4) v1(35.58,46.91) v1(35.58,46.21) v1(35.58,45.51) v1(36.28,46.91) v1(36.28,46.21) v1(36.28,45.51) v1(36.98,46.91) v1(36.98,46.21) v1(36.98,45.51)
SW2: length 14.3
  Top Layer w0.2: 43,33.72 43.79,33.72 45.01,34.94 C26.1 45.01,45.04 v1(45.48,45.51) v1(46.18,46.21)
  vias: v1(45.48,46.91) v1(45.48,46.21) v1(46.18,46.91) v1(46.18,45.51) v1(46.88,46.91) v1(46.88,46.21) v1(46.88,45.51) v1(50.27,45.53) v1(50.27,44.83) v1(50.27,44.13) v1(50.97,45.53) v1(50.97,44.83) v1(50.97,44.13) v1(51.67,45.53) v1(51.67,44.83) v1(51.67,44.13)
SWCLK: length 20.7
  Top Layer w0.2: U8.20 20.9,24.8 v1(20.02,23.92) ; U10.4 9.35,14.78 v1(9.35,15.79)
  Bottom Layer w0.2: v1(9.35,15.79) 9.35,17.69 11,19.34 15.45,19.34 v1(20.02,23.92)
SWDIO: length 20.4
  Top Layer w0.2: v1(20.02,22.9) 21.55,24.44 U8.19 ; U10.3 10.62,14.76 v1(10.62,15.79)
  Bottom Layer w0.2: v1(20.02,22.9) 15.83,18.71 11.51,18.71 10.62,17.82 v1(10.62,15.79)
TX1: length 28.8
  Top Layer w0.2: U12.5 8.46,20.34 8.46,16.55 7.95,16.04 7.95,9.95 13.42,4.49 13.42,3.09 14.18,2.33 15.81,2.33 CN3.2
TX2: length 12.4
  Top Layer w0.2: v1(18.24,25.57) 16.99,25.57 U12.8 ; v1(24.97,25.95) 24.97,25.82 26.1,24.69 U8.9
  Bottom Layer w0.2: v1(24.97,25.95) 18.62,25.95 v1(18.24,25.57)
VDRV: length 14.5
  Top Layer w0.2: v1(41.35,35.73) 41.15,35.53 U4.28 ; C30.1 41.15,37.41 41.15,35.73 ; R31.2 35.04,28.74 v1(34.24,28.74)
  Bottom Layer w0.2: v1(41.35,35.73) 40.72,35.09 40.59,35.09 v1(34.24,28.74)
VOUT: length 35.4
  Top Layer w0.3: U15.2 71.34,28.98 76.66,23.66 76.66,11.91 CN4.4
  vias: v1(59.89,29.4) v1(59.89,28.7) v1(59.89,28) v1(60.59,29.4) v1(60.59,28.7) v1(60.59,28) v1(61.29,29.4) v1(61.29,28.7) v1(61.29,28)
VSYS: length 48.7
  Top Layer w0.2: Q7.3 55.07,35.22 46.05,35.22 44.15,33.32 U4.22
  Bottom Layer w0.8: v1(37.29,10.2) v1(37.29,10.87) v1(37.29,17.33) v1(37.29,18.09) 37.29,19.22 41.48,23.41 48.91,23.41 v1(54.37,28.87)
  vias: v1(50.71,49.25) v1(50.71,48.55) v1(50.71,47.85) v1(51.41,49.25) v1(51.41,48.55) v1(51.41,47.85) v1(52.11,49.25) v1(52.11,48.55) v1(52.11,47.85) v1(54.37,30.6) v1(54.37,29.7) v1(55.58,30.6) v1(55.58,29.7) v1(55.58,28.86) v1(57.53,30.6) v1(57.53,29.58) v1(57.53,28.7) v1(58.88,44.36) v1(58.88,43.73) v1(59.5,44.36) v1(59.49,43.73) v1(60.17,44.36) v1(60.14,43.73) v1(60.82,44.36) v1(60.8,43.73)
VUP: length 14.8
  Top Layer w0.2: U1.16 51.06,10.28 50.63,10.71 50.63,17.31 51.39,18.08 U1.28 51.46,19.21 R7.1
$1N1967: length 9.7
  Top Layer w0.2: C9.1 58.24,9.83 R17.1 54.82,10.36 54.82,12.36 53.65,13.53 U1.21
$1N1968: length 8.2
  Top Layer w0.2: 56.79,11.73 R10.1 ; 56.79,11.73 C4.1 ; 56.79,11.73 56.34,11.73 55.83,12.23 55.83,13.12 54.13,14.83 U1.23
$1N1969: length 7
  Top Layer w0.2: C3.1 58.24,16.22 R6.1 56.22,14.77 54.86,16.13 U1.25
$1N1970: length 6.6
  Top Layer w0.2: C1.1 58.24,19.41 R1.1 56.78,17.95 55.07,17.95 54.55,17.43 U1.27
$1N1971: length 11.8
  Top Layer w0.2: U1.20 53.54,12.88 54.18,12.23 54.18,9.44 56.09,7.53 59.37,7.53 R20.1
$1N1972: length 9.9
  Top Layer w0.2: R16.1 59.48,10.84 56.21,10.84 55.33,11.72 55.33,12.74 53.89,14.18 U1.22
$1N1973: length 8.6
  Top Layer w0.2: U1.24 54.36,15.48 55.83,14.01 59.46,14.01 R9.1
$1N1974: length 8.1
  Top Layer w0.2: R3.1 59.44,17.19 55.33,17.19 54.94,16.8 52.62,16.8 U1.26
$1N1975: length 4.6
  Top Layer w0.2: R5.1 46.6,19.94 48.21,18.33 48.21,17.69 47.95,17.43 U1.2
$1N1976: length 6.1
  Top Layer w0.2: R4.1 45.55,20.51 45.55,17.06 45.83,16.78 U1.3
$1N1979: length 4.2
  Top Layer w0.2: R15.2 43.86,9.02 45.77,10.93 U1.12
$1N1980: length 4.2
  Top Layer w0.2: U1.10 45.54,12.23 43.73,10.42 R14.2
$1N1981: length 3.9
  Top Layer w0.2: R13.2 43.98,11.69 45.18,12.88 U1.9
$1N1982: length 12.9
  Top Layer w0.2: U1.8 46.84,13.5 43.99,13.5 R12.2 42.89,13.5 v1(42.88,13.5)
  Bottom Layer w0.2: v1(42.88,13.5) 40.59,13.5 40.21,13.12 NOREF#6.1
$1N1983: length 3.7
  Top Layer w0.2: C8.1 44.44,14.73 45,14.18 U1.7
$1N1984: length 4.1
  Top Layer w0.2: C7.1 44.31,16.26 45.74,14.83 U1.6
$1N1985: length 4.8
  Top Layer w0.2: U1.5 45.86,15.48 44.66,16.68 44.66,17.44 44.44,17.66 C6.1
$1N1986: length 5.7
  Top Layer w0.2: C5.1 44.57,19.05 45.16,18.46 45.16,16.8 45.84,16.13 U1.4
$1N1992: length 12.6
  Top Layer w0.2: Q4.4 56.41,5.56 55.45,6.52 R19.2 53.79,7.41 52.15,7.41 47.98,11.58 U1.11
$1N1993: length 13.4
  Top Layer w0.2: Q5.4 48.39,2.71 v1(47.32,2.71) ; v1(41.61,8.3) 41.61,8.7 R15.1
  Bottom Layer w0.2: v1(41.61,8.3) 41.61,3.34 42.24,2.71 v1(47.32,2.71)
$1N1994: length 4.2
  Top Layer w0.2: Q6.3 64.6,9.98 R18.1
$1N1995: length 6
  Top Layer w0.2: Q6.1 62.04,8.07 R20.2
$1N1996: length 4.2
  Top Layer w0.2: Q3.3 64.71,13.17 R11.1
$1N1997: length 5.9
  Top Layer w0.2: R16.2 61.93,11.37 Q3.1
$1N1998: length 4.1
  Top Layer w0.2: R8.1 64.82,16.37 Q2.3
$1N1999: length 5.9
  Top Layer w0.2: Q2.1 61.82,14.67 R9.2
$1N2000: length 4.1
  Top Layer w0.2: R2.1 64.93,19.56 Q1.3
$1N2001: length 5.8
  Top Layer w0.2: Q1.1 61.74,17.98 R3.2
$2N9896: length 38
  Top Layer w0.2: R26.2 31.48,34.18 C16.2 29.13,34.18 28.6,33.66 28.4,33.66 26.16,35.9 26.16,46 26.31,46.14 R23.2 ; 38.9,34.12 38.12,34.9 C29.1 38.12,36.04 37.42,36.74 32.08,36.74 29.04,39.79 29.04,46.65 28.78,46.9
  vias: v1(29.67,47.73) v1(29.67,47.03) v1(29.67,46.33) v1(30.37,47.73) v1(30.37,47.03) v1(30.37,46.33) v1(31.07,47.73) v1(31.07,47.03) v1(31.07,46.33)
$2N9898: length 7.5
  Top Layer w0.2: C27.2 33,31.58 R25.1 33.4,33.32 U4.3
$2N9899: length 7.5
  Top Layer w0.2: 38.9,33.72 33.47,33.72 R26.1 33,35.53 C28.2
$2N9906: length 18.2
  Top Layer w0.2: 43,32.92 44.51,32.92 46.05,34.46 55.58,34.46 Q7.4
$2N9908: length 18.5
  Top Layer w0.2: R24.1 63.14,35.6 63.28,35.46 63.28,34.58 61.28,32.59 51.46,32.59 50.93,33.11 C22.1 50.22,33.05 R27.2
  vias: v1(62.38,40.62) v1(62.38,39.92) v1(62.38,39.22) v1(63.08,40.62) v1(63.08,39.92) v1(63.08,39.22) v1(63.78,40.62) v1(63.78,39.92) v1(63.78,39.22)
$2N10694: length 3.8
  Top Layer w0.2: R27.1 46.08,32.52 U4.20
$2N10699: length 3.8
  Top Layer w0.2: 43,32.12 46.14,32.12 R28.1
$2N11055: length 7.1
  Top Layer w0.2: C35.2 47.67,26.25 R36.2 43,30.92 U4.17
$2N11060: length 1.6
  Top Layer w0.2: R36.1 C37.2
$2N11209: length 5
  Top Layer w0.2: U4.16 42.35,28.27 R35.2 43.8,27.83 C34.2
$2N11213: length 1.6
  Top Layer w0.2: R35.1 C36.2
$2N11400: length 7.1
  Top Layer w0.2: R34.1 R37.2 45.31,30 43.59,31.72 43,31.72
$2N11711: length 10.1
  Top Layer w0.2: U4.8 38.6,31.32 38.43,31.16 38.43,28.63 C32.2 34.61,24.91 R32.2
$2N11917: length 7.2
  Top Layer w0.2: U4.9 39.55,30.37 39.2,30.01 39.2,28.49 36.31,25.6 C33.2
$2N12015: length 6.6
  Top Layer w0.2: R33.2 37.84,26.24 39.96,28.36 U4.10
$2N12389: length 3
  Top Layer w0.2: U6.9 17.23,37.25 17.48,37.51 17.48,38.29 R39.2
$2N12394: length 2.1
  Top Layer w0.2: U6.8 16.78,36.74 17.59,36.74 R38.2
$2N18353: length 2.2
  Top Layer w0.2: R58.2 32.59,49.71 Q8.2
$2N18407: length 3.7
  Top Layer w0.2: Q10.2 34.16,39.22 R59.2
$2N18436: length 9.2
  Top Layer w0.3: Q9.2 48.97,47.2 v1(48.97,46.78) ; v1(48.21,40.3) 47.23,39.32 R60.1
  Bottom Layer w0.3: v1(48.21,40.3) 48.97,41.06 v1(48.97,46.78)
$2N18466: length 4.5
  Top Layer w0.2: R61.1 51.95,41.61 Q11.2
$3N1326: length 7
  Top Layer w0.2: R53.1 4.78,32.67 4.78,29.12 5.69,28.22 U11.A5
$3N1328: length 6.6
  Top Layer w0.2: U11.B5 5.7,25.22 4.65,24.17 R50.1
$3N1341: length 10.4
  Top Layer w0.2: U12.4 11.52,24.56 9.58,24.56 ; U11.B4A9 9.58,24.56 ; 9.58,24.56 9.48,24.67 v1(9.48,25.44) ; U11.A4B9 9.24,29.36 v1(9.48,29.12)
  Bottom Layer w0.2: v1(9.48,29.12) v1(9.48,25.44)
$3N1407: length 6.5
  Top Layer w0.2: U11.B6 v1(8.97,26.22) ; U12.1 10.65,27.48 10.32,27.16 8.8,27.16 8.78,27.14 8.58,27.14 8.51,27.22 U11.A6
  Bottom Layer w0.2: v1(8.97,26.22) v1(8.97,27.35)
$3N1440: length 7.9
  Top Layer w0.2: v1(6.3,26.71) 6.31,26.72 U11.A7 8.51,26.72 8.58,26.79 8.93,26.79 8.94,26.8 10.32,26.8 10.65,26.48 U12.2 ; U11.B7 v1(6.3,27.72)
  Bottom Layer w0.2: v1(6.3,27.72) v1(6.3,26.71)
$3N1667: length 8.4
  Top Layer w0.2: 16.78,29.25 16.9,29.13 U12.10 18.11,27.48 18.88,26.71 18.88,24.85 18.5,24.48 ; U12.7 18.5,24.48 ; 18.5,24.48 C55.2
$3N4191: length 2
  Top Layer w0.5: U18.1 31.32,14.33 C39.2
$3N4511: length 5.5
  Top Layer w0.2: C40.1 30.68,10.51 R44.1 R47.2 33.67,13.56 U18.3
$3N6002: length 6.1
  Top Layer w0.2: Q13.3 58.65,24.79 Q12.4 55.65,26.79 R45.1
$3N6004: length 2
  Top Layer w0.2: Q13.1 58.46,23.16 R46.2
$3N9179: length 1.9
  Top Layer w0.2: 44.91,1.31 44.91,1.31 R54.1
$3N9201: length 1.8
  Top Layer w0.2: LED2.1 36.78,1.31 R55.1
$3N14511: length 5.3
  Top Layer w0.2: 30.75,2.33 30.82,2.39 R63.1 32.31,4.02 R62.2 33.52,5.15 U16.3
$3N14515: length 1.7
  Top Layer w0.3: 31.62,5.58 31.25,5.94 C50.2

## Copper pours and planes (outline as drawn; the poured copper is in the pictures)
3.3V on Top Layer: 24.83,14.63 28.91,14.63 28.91,13.12 24.83,13.12
5V on Top Layer: 24.84,6.39 28.95,6.39 28.95,4.68 24.84,4.68
AGND on Top Layer: -0.94,33.7 28.16,33.7 30.95,30.9 31.77,30.9 32.25,30.43 32.25,29.89 32.67,29.47 36.57,29.47 39.96,26.08 39.96,22.52 39.45,22.01 30.43,22.01 22.18,13.76 6.05,13.76 -0.94,20.74
AGND on Bottom Layer: -0.94,33.7 28.16,33.7 30.95,30.9 31.77,30.9 32.25,30.43 32.25,29.89 32.67,29.47 35.43,29.47 40.21,24.68 40.21,22.77 35.77,18.33 22.18,18.33 17.61,13.76 6.05,13.76 -0.94,20.74
GND on Top Layer: -1.83,55.79 83.27,55.79 83.27,-3.64 -1.83,-3.64
GND on Bottom Layer: -1.44,54.27 81.74,54.27 81.74,-3.01 -1.44,-3.01
VBUS on Top Layer: 7.07,42.49 8.5,42.49 14.43,48.43 24.46,48.43 25.04,47.85 25.04,44.59 24.51,44.06 17.68,44.06 15.19,41.57 13.67,41.57 9.1,37 7.25,37 7.25,37.36 7.22,37.73 8.42,37.71 8.65,37.95 8.65,41.89 7.67,41.89
VIN on Top Layer: 46.56,5.4 49.23,5.4 49.23,3.47 46.56,3.47
B- on Top Layer: 41.89,6.59 41.89,3.57 42.37,3.09 44.66,3.09 44.91,3.34 44.91,5.14 43.47,6.59
B- on Top Layer: 40.59,19.73 42.5,19.73 42.5,10.96 40.59,10.96
B- on Bottom Layer: 72.73,34.58 69.39,31.24 69.39,23.16 66.21,19.98 40.21,19.98 40.21,9.69 41.61,8.3 41.61,3.34 42.24,2.71 43.38,2.71 48.61,7.94 71.23,7.94 73.23,9.95 73.23,24.17 78.06,29 78.06,33.55 77.02,34.58
BAT4 on Top Layer: 78.95,39.28 76.79,41.44 72.72,41.44 70.04,38.76 66.49,38.76 64.4,36.68 64.4,34.78 64.6,34.58 76.79,34.58 78.95,36.74
SW1 on Top Layer: 32.34,47.67 32.34,45.75 31.68,45.1 30.66,45.1 30.05,44.49 30.05,42.2 30.43,41.82 35.51,41.82 38.18,44.49 38.18,47.67 38.05,47.79 32.47,47.79
SW2 on Top Layer: 45.8,49.83 44.4,48.43 44.4,44.49 45.16,43.73 52.17,43.73 52.87,44.43 52.87,45.67 52.15,46.4 50.75,46.4 49.86,47.28 49.86,49.57 49.61,49.83
VOUT on Top Layer: 58.25,31.03 68.53,31.03 69.3,30.27 69.3,27.98 67.9,26.58 58.5,26.58 58.25,26.84
VSYS on Top Layer: 37.04,18.58 35.25,16.8 32.54,16.8 32.54,15.61 32.47,15.53 37.39,15.53 38.04,16.19 38.04,18.61 38.01,18.58
VSYS on Top Layer: 54.06,31.03 57.74,31.03 57.74,27.22 54.06,27.22
VSYS on Top Layer: 50.25,50.33 50.25,47.42 51.01,46.66 52.02,46.66 54.06,44.62 58.25,44.62 58.25,39.03 58.63,38.65 59.64,38.65 60.02,39.03 60.02,41.32 62.31,43.6 62.31,47.54 61.17,48.68 53.93,48.68 52.4,50.21 52.15,50.21 52.02,50.33
VSYS on Top Layer: 36.91,11.34 35.89,10.33 32.21,10.33 32.21,7.41 32.34,7.28 33.8,7.28 34.69,8.17 38.18,8.17 38.31,8.3 38.31,11.22 38.18,11.34
VSYS on Bottom Layer: 58.37,44.74 58.37,35.73 53.93,31.28 53.93,28.55 54.06,28.42 57.92,28.42 61.29,31.79 61.29,44.74
$1N1987 on Top Layer: 49.64,5.37 55.55,5.37 55.55,2.76 49.64,2.76
$2N9896 on Top Layer: 26.93,47.03 28.58,48.68 31.78,48.68 31.78,45.7 31.46,45.38 26.94,45.38 26.93,45.39
$2N9908 on Top Layer: 60.48,42.13 60.48,35.48 61.14,34.82 62.58,34.82 62.58,36.5 63.2,37.12 64.72,37.12 65.49,37.89 65.49,41.95 65.31,42.13
$3N4166 on Top Layer: 26.88,16.84 32.15,16.84 32.15,15.31 26.88,15.31
$3N14514 on Top Layer: 27,8.55 31.96,8.55 31.96,7.03 27,7.03

## Text on the board
Bottom Silkscreen Layer: NTC电阻
Top Solder Mask Layer: 四节锂电池电源V2 | KEVIN | 2025年5月10日
Top Silkscreen Layer: 复位 | 风扇 | SK150C串口 | SWCLK | SWDIO | GND | 3V3
